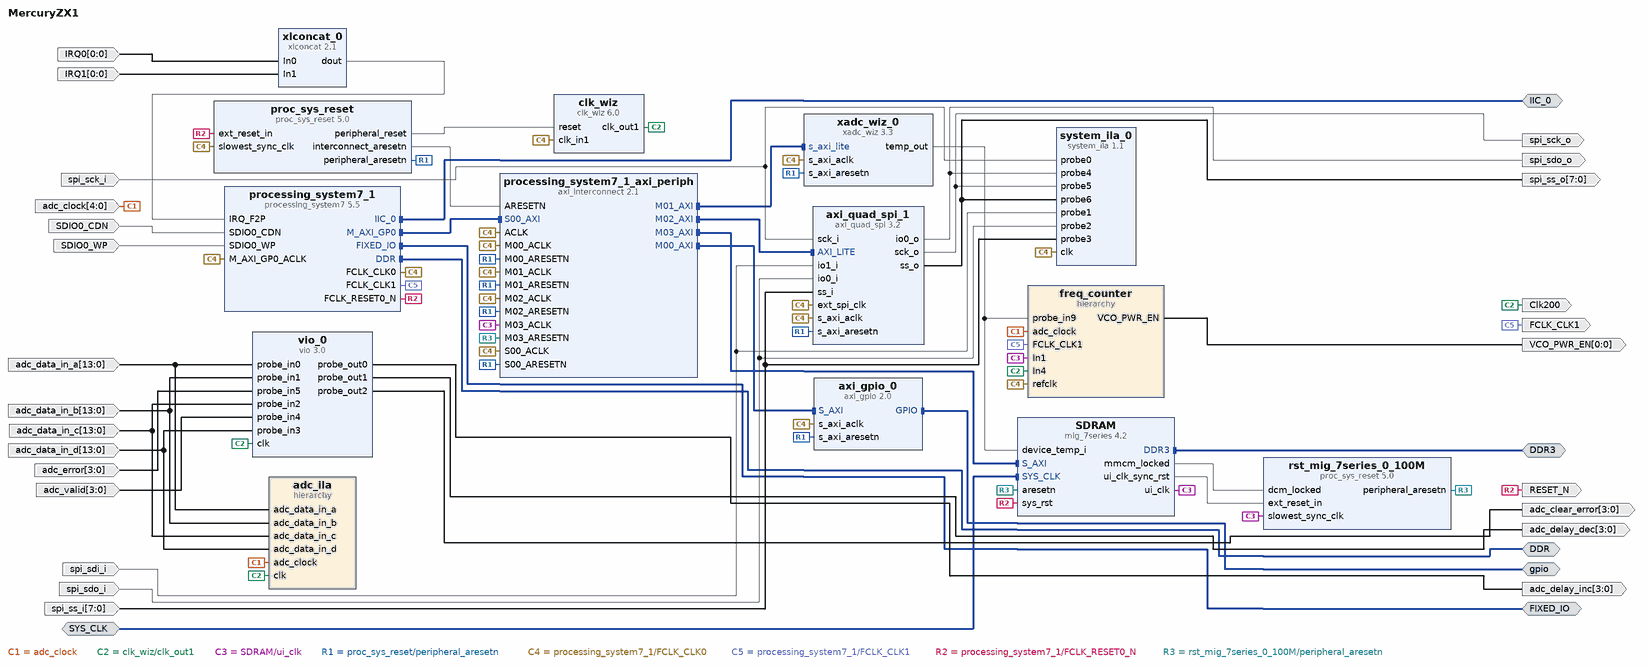
[diagram p0: block diagram of the top level]
# Vivado block design MercuryZX1, xc7z030fbg676-2, Vivado 2019.1
create_bd_design MercuryZX1

create_bd_intf_port -mode Master -vlnv xilinx.com:interface:ddrx_rtl:1.0 DDR
create_bd_intf_port -mode Master -vlnv xilinx.com:interface:ddrx_rtl:1.0 DDR3
create_bd_intf_port -mode Master -vlnv xilinx.com:display_processing_system7:fixedio_rtl:1.0 FIXED_IO
create_bd_intf_port -mode Master -vlnv xilinx.com:interface:iic_rtl:1.0 IIC_0
create_bd_intf_port -mode Slave -vlnv xilinx.com:interface:diff_clock_rtl:1.0 SYS_CLK
create_bd_intf_port -mode Master -vlnv xilinx.com:interface:gpio_rtl:1.0 gpio
create_bd_port -dir I spi_sck_i
create_bd_port -dir O spi_sck_o
create_bd_port -dir I spi_sdi_i
create_bd_port -dir I spi_sdo_i
create_bd_port -dir O spi_sdo_o
create_bd_port -dir I -from 7 -to 0 spi_ss_i
create_bd_port -dir O -from 7 -to 0 spi_ss_o
create_bd_port -dir O -type clk Clk200
create_bd_port -dir O -from 3 -to 0 adc_clear_error
create_bd_port -dir I -from 4 -to 0 adc_clock
create_bd_port -dir I -from 13 -to 0 adc_data_in_a
create_bd_port -dir I -from 13 -to 0 adc_data_in_b
create_bd_port -dir I -from 13 -to 0 adc_data_in_c
create_bd_port -dir I -from 13 -to 0 adc_data_in_d
create_bd_port -dir O -from 3 -to 0 adc_delay_dec
create_bd_port -dir O -from 3 -to 0 adc_delay_inc
create_bd_port -dir I -from 3 -to 0 adc_error
create_bd_port -dir I -from 3 -to 0 adc_valid
create_bd_port -dir O -type clk FCLK_CLK1
create_bd_port -dir I -from 0 -to 0 IRQ0
create_bd_port -dir I -from 0 -to 0 IRQ1
create_bd_port -dir O RESET_N
create_bd_port -dir I SDIO0_CDN
create_bd_port -dir I SDIO0_WP
create_bd_port -dir O -from 0 -to 0 VCO_PWR_EN

create_bd_cell -type ip -vlnv xilinx.com:ip:mig_7series:4.2 SDRAM
set_property -dict [list \
  CONFIG.BOARD_MIG_PARAM Custom \
  CONFIG.MIG_DONT_TOUCH_PARAM Custom \
  CONFIG.RESET_BOARD_INTERFACE Custom \
  CONFIG.XML_INPUT_FILE mig_a.prj \
] [get_bd_cells SDRAM]
create_bd_cell -type ip -vlnv xilinx.com:ip:axi_quad_spi:3.2 axi_quad_spi_1
set_property -dict {CONFIG.C_NUM_SS_BITS 8 CONFIG.C_USE_STARTUP 0} [get_bd_cells axi_quad_spi_1]
create_bd_cell -type ip -vlnv xilinx.com:ip:clk_wiz:6.0 clk_wiz
set_property -dict [list \
  CONFIG.CLKOUT1_JITTER 114.829 \
  CONFIG.CLKOUT1_REQUESTED_OUT_FREQ 200 \
  CONFIG.MMCM_CLKOUT0_DIVIDE_F 5.000 \
] [get_bd_cells clk_wiz]
create_bd_cell -type hier adc_ila
create_bd_cell -type hier freq_counter
create_bd_cell -type ip -vlnv xilinx.com:ip:system_ila:1.1 system_ila_0
set_property -dict [list \
  CONFIG.C_MON_TYPE NATIVE \
  CONFIG.C_NUM_OF_PROBES 7 \
  CONFIG.C_PROBE0_TYPE 0 \
  CONFIG.C_PROBE1_TYPE 0 \
  CONFIG.C_PROBE2_TYPE 0 \
  CONFIG.C_PROBE3_TYPE 0 \
  CONFIG.C_PROBE4_TYPE 0 \
  CONFIG.C_PROBE5_TYPE 0 \
  CONFIG.C_PROBE6_TYPE 0 \
] [get_bd_cells system_ila_0]
create_bd_cell -type ip -vlnv xilinx.com:ip:xlconcat:2.1 xlconcat_0
create_bd_cell -type ip -vlnv xilinx.com:ip:axi_gpio:2.0 axi_gpio_0
set_property -dict {CONFIG.C_ALL_OUTPUTS 1 CONFIG.C_GPIO_WIDTH 8} [get_bd_cells axi_gpio_0]
create_bd_cell -type ip -vlnv xilinx.com:ip:proc_sys_reset:5.0 proc_sys_reset
set_property -dict {CONFIG.C_AUX_RESET_HIGH 0} [get_bd_cells proc_sys_reset]
create_bd_cell -type ip -vlnv xilinx.com:ip:processing_system7:5.5 processing_system7_1
set_property -dict [list \
  CONFIG.PCW_APU_PERIPHERAL_FREQMHZ 666 \
  CONFIG.PCW_DCI_PERIPHERAL_CLKSRC 1 \
  CONFIG.PCW_ENET0_ENET0_IO {MIO 16 .. 27} \
  CONFIG.PCW_ENET0_GRP_MDIO_ENABLE 1 \
  CONFIG.PCW_ENET0_GRP_MDIO_IO {MIO 52 .. 53} \
  CONFIG.PCW_ENET0_PERIPHERAL_ENABLE 1 \
  CONFIG.PCW_ENET_RESET_ENABLE 0 \
  CONFIG.PCW_EN_CLK1_PORT 1 \
  CONFIG.PCW_FCLK_CLK1_BUF TRUE \
  CONFIG.PCW_FPGA0_PERIPHERAL_FREQMHZ 100 \
  CONFIG.PCW_FPGA2_PERIPHERAL_FREQMHZ 25 \
  CONFIG.PCW_FPGA3_PERIPHERAL_FREQMHZ 33 \
  CONFIG.PCW_FPGA_FCLK1_ENABLE 1 \
  CONFIG.PCW_GP0_EN_MODIFIABLE_TXN 0 \
  CONFIG.PCW_GP1_EN_MODIFIABLE_TXN 0 \
  CONFIG.PCW_GPIO_MIO_GPIO_ENABLE 1 \
  CONFIG.PCW_GPIO_MIO_GPIO_IO MIO \
  CONFIG.PCW_I2C0_I2C0_IO EMIO \
  CONFIG.PCW_I2C0_PERIPHERAL_ENABLE 1 \
  CONFIG.PCW_I2C_PERIPHERAL_FREQMHZ 111.111115 \
  CONFIG.PCW_I2C_RESET_ENABLE 0 \
  CONFIG.PCW_IRQ_F2P_INTR 1 \
  CONFIG.PCW_PCAP_PERIPHERAL_CLKSRC 1 \
  CONFIG.PCW_PRESET_BANK0_VOLTAGE {LVCMOS 2.5V} \
  CONFIG.PCW_PRESET_BANK1_VOLTAGE {LVCMOS 2.5V} \
  CONFIG.PCW_QSPI_GRP_FBCLK_ENABLE 1 \
  CONFIG.PCW_QSPI_GRP_FBCLK_IO {MIO 8} \
  CONFIG.PCW_QSPI_GRP_SINGLE_SS_ENABLE 1 \
  CONFIG.PCW_QSPI_GRP_SINGLE_SS_IO {MIO 1 .. 6} \
  CONFIG.PCW_QSPI_PERIPHERAL_ENABLE 1 \
  CONFIG.PCW_QSPI_QSPI_IO {MIO 1 .. 6} \
  CONFIG.PCW_SD0_GRP_CD_ENABLE 1 \
  CONFIG.PCW_SD0_GRP_CD_IO EMIO \
  CONFIG.PCW_SD0_GRP_WP_ENABLE 1 \
  CONFIG.PCW_SD0_GRP_WP_IO EMIO \
  CONFIG.PCW_SD0_PERIPHERAL_ENABLE 1 \
  CONFIG.PCW_SD0_SD0_IO {MIO 40 .. 45} \
  CONFIG.PCW_SDIO_PERIPHERAL_FREQMHZ 50 \
  CONFIG.PCW_SINGLE_QSPI_DATA_MODE x4 \
  CONFIG.PCW_TPIU_PERIPHERAL_CLKSRC {IO PLL} \
  CONFIG.PCW_TTC0_PERIPHERAL_ENABLE 1 \
  CONFIG.PCW_TTC0_TTC0_IO EMIO \
  CONFIG.PCW_UART0_PERIPHERAL_ENABLE 1 \
  CONFIG.PCW_UART0_UART0_IO {MIO 46 .. 47} \
  CONFIG.PCW_UART1_PERIPHERAL_ENABLE 0 \
  CONFIG.PCW_UART_PERIPHERAL_FREQMHZ 100 \
  CONFIG.PCW_UIPARAM_DDR_FREQ_MHZ 533 \
  CONFIG.PCW_UIPARAM_DDR_PARTNO {MT41K256M16 RE-125} \
  CONFIG.PCW_USB0_PERIPHERAL_ENABLE 1 \
  CONFIG.PCW_USB0_USB0_IO {MIO 28 .. 39} \
  CONFIG.PCW_USB_RESET_ENABLE 0 \
  CONFIG.PCW_USE_FABRIC_INTERRUPT 1 \
  CONFIG.PCW_WDT_PERIPHERAL_ENABLE 1 \
  CONFIG.PCW_WDT_WDT_IO EMIO \
] [get_bd_cells processing_system7_1]
# 263 more settings of processing_system7_1 are not shown: defaults, MIO pin electricals, DDR timing, and values the tool derives
create_bd_cell -type ip -vlnv xilinx.com:ip:axi_interconnect:2.1 processing_system7_1_axi_periph
set_property -dict {CONFIG.NUM_MI 4} [get_bd_cells processing_system7_1_axi_periph]
create_bd_cell -type ip -vlnv xilinx.com:ip:proc_sys_reset:5.0 rst_mig_7series_0_100M
create_bd_cell -type ip -vlnv xilinx.com:ip:xadc_wiz:3.3 xadc_wiz_0
set_property -dict [list \
  CONFIG.ENABLE_RESET false \
  CONFIG.ENABLE_TEMP_BUS true \
  CONFIG.INTERFACE_SELECTION Enable_AXI \
  CONFIG.TEMPERATURE_ALARM_OT_TRIGGER 85 \
] [get_bd_cells xadc_wiz_0]
create_bd_cell -type ip -vlnv xilinx.com:ip:vio:3.0 vio_0
set_property -dict [list \
  CONFIG.C_NUM_PROBE_IN 6 \
  CONFIG.C_NUM_PROBE_OUT 3 \
  CONFIG.C_PROBE_OUT0_WIDTH 4 \
  CONFIG.C_PROBE_OUT1_WIDTH 4 \
  CONFIG.C_PROBE_OUT2_WIDTH 4 \
] [get_bd_cells vio_0]

# ---- hierarchy /adc_ila ----
current_bd_instance /adc_ila
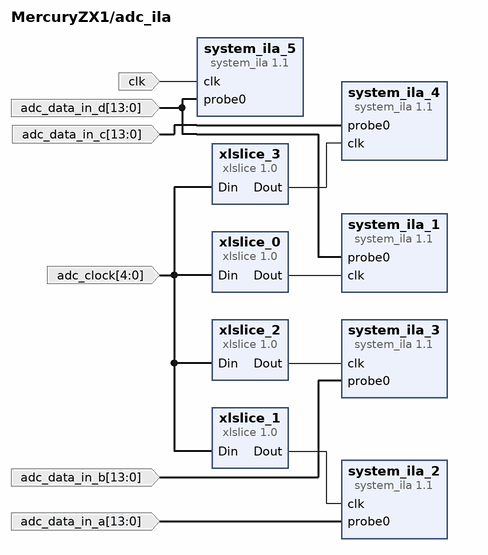
[diagram p1: block diagram inside /adc_ila]
create_bd_pin -dir I -from 4 -to 0 adc_clock
create_bd_pin -dir I -from 13 -to 0 adc_data_in_a
create_bd_pin -dir I -from 13 -to 0 adc_data_in_b
create_bd_pin -dir I -from 13 -to 0 adc_data_in_c
create_bd_pin -dir I -from 13 -to 0 adc_data_in_d
create_bd_pin -dir I -type clk clk

create_bd_cell -type ip -vlnv xilinx.com:ip:system_ila:1.1 system_ila_1
set_property -dict {CONFIG.C_MON_TYPE NATIVE CONFIG.C_NUM_OF_PROBES 1 CONFIG.C_PROBE0_TYPE 0} [get_bd_cells system_ila_1]
create_bd_cell -type ip -vlnv xilinx.com:ip:system_ila:1.1 system_ila_2
set_property -dict {CONFIG.C_MON_TYPE NATIVE CONFIG.C_NUM_OF_PROBES 1 CONFIG.C_PROBE0_TYPE 0} [get_bd_cells system_ila_2]
create_bd_cell -type ip -vlnv xilinx.com:ip:system_ila:1.1 system_ila_3
set_property -dict {CONFIG.C_MON_TYPE NATIVE CONFIG.C_NUM_OF_PROBES 1 CONFIG.C_PROBE0_TYPE 0} [get_bd_cells system_ila_3]
create_bd_cell -type ip -vlnv xilinx.com:ip:system_ila:1.1 system_ila_4
set_property -dict {CONFIG.C_MON_TYPE NATIVE CONFIG.C_NUM_OF_PROBES 1 CONFIG.C_PROBE0_TYPE 0} [get_bd_cells system_ila_4]
create_bd_cell -type ip -vlnv xilinx.com:ip:system_ila:1.1 system_ila_5
set_property -dict {CONFIG.C_MON_TYPE NATIVE CONFIG.C_NUM_OF_PROBES 1 CONFIG.C_PROBE0_TYPE 0} [get_bd_cells system_ila_5]
create_bd_cell -type ip -vlnv xilinx.com:ip:xlslice:1.0 xlslice_0
set_property -dict {CONFIG.DIN_FROM 0 CONFIG.DIN_TO 0 CONFIG.DIN_WIDTH 5} [get_bd_cells xlslice_0]
create_bd_cell -type ip -vlnv xilinx.com:ip:xlslice:1.0 xlslice_1
set_property -dict {CONFIG.DIN_FROM 1 CONFIG.DIN_TO 1 CONFIG.DIN_WIDTH 5 CONFIG.DOUT_WIDTH 1} [get_bd_cells xlslice_1]
create_bd_cell -type ip -vlnv xilinx.com:ip:xlslice:1.0 xlslice_2
set_property -dict {CONFIG.DIN_FROM 2 CONFIG.DIN_TO 2 CONFIG.DIN_WIDTH 5 CONFIG.DOUT_WIDTH 1} [get_bd_cells xlslice_2]
create_bd_cell -type ip -vlnv xilinx.com:ip:xlslice:1.0 xlslice_3
set_property -dict {CONFIG.DIN_FROM 3 CONFIG.DIN_TO 3 CONFIG.DIN_WIDTH 5 CONFIG.DOUT_WIDTH 1} [get_bd_cells xlslice_3]

# ---- hierarchy /freq_counter ----
current_bd_instance /freq_counter
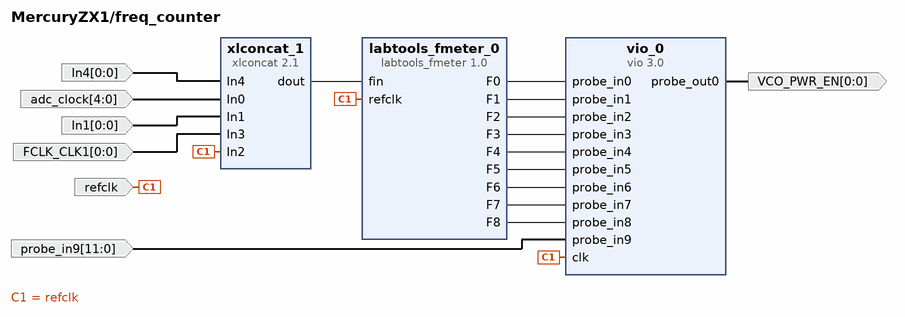
[diagram p2: block diagram inside /freq_counter]
create_bd_pin -dir I -from 0 -to 0 FCLK_CLK1
create_bd_pin -dir I -from 0 -to 0 In1
create_bd_pin -dir I -from 0 -to 0 In4
create_bd_pin -dir O -from 0 -to 0 VCO_PWR_EN
create_bd_pin -dir I -from 4 -to 0 adc_clock
create_bd_pin -dir I -from 11 -to 0 probe_in9
create_bd_pin -dir I -type clk refclk

create_bd_cell -type ip -vlnv trenz.biz:user:labtools_fmeter:1.0 labtools_fmeter_0
set_property -dict {CONFIG.C_CHANNELS 9} [get_bd_cells labtools_fmeter_0]
create_bd_cell -type ip -vlnv xilinx.com:ip:vio:3.0 vio_0
set_property -dict {CONFIG.C_NUM_PROBE_IN 10 CONFIG.C_PROBE_OUT0_INIT_VAL 0001} [get_bd_cells vio_0]
create_bd_cell -type ip -vlnv xilinx.com:ip:xlconcat:2.1 xlconcat_1
set_property -dict {CONFIG.IN0_WIDTH 5 CONFIG.NUM_PORTS 5} [get_bd_cells xlconcat_1]

# ---- connections ----

current_bd_instance /adc_ila
connect_bd_net [get_bd_pins adc_clock] [get_bd_pins xlslice_0/Din] [get_bd_pins xlslice_1/Din] [get_bd_pins xlslice_2/Din] [get_bd_pins xlslice_3/Din]
connect_bd_net -net adc_data_in_a_1 [get_bd_pins adc_data_in_a] [get_bd_pins system_ila_2/probe0]
connect_bd_net -net adc_data_in_b_1 [get_bd_pins adc_data_in_b] [get_bd_pins system_ila_3/probe0]
connect_bd_net -net adc_data_in_c_1 [get_bd_pins adc_data_in_c] [get_bd_pins system_ila_4/probe0]
connect_bd_net -net adc_data_in_d_1 [get_bd_pins adc_data_in_d] [get_bd_pins system_ila_1/probe0] [get_bd_pins system_ila_5/probe0]
connect_bd_net [get_bd_pins clk] [get_bd_pins system_ila_5/clk]
connect_bd_net [get_bd_pins xlslice_0/Dout] [get_bd_pins system_ila_1/clk]
connect_bd_net [get_bd_pins xlslice_1/Dout] [get_bd_pins system_ila_2/clk]
connect_bd_net [get_bd_pins xlslice_2/Dout] [get_bd_pins system_ila_3/clk]
connect_bd_net [get_bd_pins xlslice_3/Dout] [get_bd_pins system_ila_4/clk]
set_property HDL_ATTRIBUTE.DEBUG true [get_bd_nets adc_data_in_a_1]
set_property HDL_ATTRIBUTE.DEBUG true [get_bd_nets adc_data_in_b_1]
set_property HDL_ATTRIBUTE.DEBUG true [get_bd_nets adc_data_in_c_1]
set_property HDL_ATTRIBUTE.DEBUG true [get_bd_nets adc_data_in_d_1]
set_property HDL_ATTRIBUTE.MARK_DEBUG true [get_bd_nets adc_data_in_d_1]

current_bd_instance /freq_counter
connect_bd_net -net In4_1 [get_bd_pins In4] [get_bd_pins xlconcat_1/In4]
connect_bd_net [get_bd_pins adc_clock] [get_bd_pins xlconcat_1/In0]
connect_bd_net [get_bd_pins labtools_fmeter_0/F0] [get_bd_pins vio_0/probe_in0]
connect_bd_net [get_bd_pins labtools_fmeter_0/F1] [get_bd_pins vio_0/probe_in1]
connect_bd_net [get_bd_pins labtools_fmeter_0/F2] [get_bd_pins vio_0/probe_in2]
connect_bd_net [get_bd_pins labtools_fmeter_0/F3] [get_bd_pins vio_0/probe_in3]
connect_bd_net [get_bd_pins labtools_fmeter_0/F4] [get_bd_pins vio_0/probe_in4]
connect_bd_net [get_bd_pins labtools_fmeter_0/F5] [get_bd_pins vio_0/probe_in5]
connect_bd_net [get_bd_pins labtools_fmeter_0/F6] [get_bd_pins vio_0/probe_in6]
connect_bd_net [get_bd_pins labtools_fmeter_0/F7] [get_bd_pins vio_0/probe_in7]
connect_bd_net [get_bd_pins labtools_fmeter_0/F8] [get_bd_pins vio_0/probe_in8]
connect_bd_net -net mig_7series_0_ui_clk [get_bd_pins In1] [get_bd_pins xlconcat_1/In1]
connect_bd_net -net probe_in9_1 [get_bd_pins probe_in9] [get_bd_pins vio_0/probe_in9]
connect_bd_net -net processing_system7_1_fclk_clk0 [get_bd_pins refclk] \
  [get_bd_pins labtools_fmeter_0/refclk] [get_bd_pins vio_0/clk] [get_bd_pins xlconcat_1/In2]
connect_bd_net -net processing_system7_1_fclk_clk1 [get_bd_pins FCLK_CLK1] [get_bd_pins xlconcat_1/In3]
connect_bd_net [get_bd_pins vio_0/probe_out0] [get_bd_pins VCO_PWR_EN]
connect_bd_net [get_bd_pins xlconcat_1/dout] [get_bd_pins labtools_fmeter_0/fin]

current_bd_instance /
connect_bd_intf_net [get_bd_intf_ports IIC_0] [get_bd_intf_pins processing_system7_1/IIC_0]
connect_bd_intf_net [get_bd_intf_ports FIXED_IO] [get_bd_intf_pins processing_system7_1/FIXED_IO]
connect_bd_intf_net [get_bd_intf_pins processing_system7_1/M_AXI_GP0] [get_bd_intf_pins processing_system7_1_axi_periph/S00_AXI]
connect_bd_intf_net [get_bd_intf_pins SDRAM/S_AXI] [get_bd_intf_pins processing_system7_1_axi_periph/M03_AXI]
connect_bd_intf_net [get_bd_intf_pins axi_quad_spi_1/AXI_LITE] [get_bd_intf_pins processing_system7_1_axi_periph/M02_AXI]
connect_bd_intf_net [get_bd_intf_ports DDR] [get_bd_intf_pins processing_system7_1/DDR]
connect_bd_intf_net [get_bd_intf_pins axi_gpio_0/S_AXI] [get_bd_intf_pins processing_system7_1_axi_periph/M00_AXI]
connect_bd_intf_net [get_bd_intf_pins processing_system7_1_axi_periph/M01_AXI] [get_bd_intf_pins xadc_wiz_0/s_axi_lite]
connect_bd_intf_net -intf_net mig_7series_0_DDR3 [get_bd_intf_ports DDR3] [get_bd_intf_pins SDRAM/DDR3]
connect_bd_intf_net -intf_net axi_gpio_1_gpio [get_bd_intf_ports gpio] [get_bd_intf_pins axi_gpio_0/GPIO]
connect_bd_intf_net [get_bd_intf_ports SYS_CLK] [get_bd_intf_pins SDRAM/SYS_CLK]
connect_bd_net -net In0_1 [get_bd_ports IRQ0] [get_bd_pins xlconcat_0/In0]
connect_bd_net -net In1_1 [get_bd_ports IRQ1] [get_bd_pins xlconcat_0/In1]
connect_bd_net [get_bd_ports SDIO0_CDN] [get_bd_pins processing_system7_1/SDIO0_CDN]
connect_bd_net [get_bd_ports SDIO0_WP] [get_bd_pins processing_system7_1/SDIO0_WP]
connect_bd_net [get_bd_ports adc_clock] [get_bd_pins adc_ila/adc_clock] [get_bd_pins freq_counter/adc_clock]
connect_bd_net -net adc_data_in_a_1 [get_bd_ports adc_data_in_a] [get_bd_pins adc_ila/adc_data_in_a] [get_bd_pins vio_0/probe_in0]
connect_bd_net -net adc_data_in_b_1 [get_bd_ports adc_data_in_b] [get_bd_pins adc_ila/adc_data_in_b] [get_bd_pins vio_0/probe_in1]
connect_bd_net -net adc_data_in_c_1 [get_bd_ports adc_data_in_c] [get_bd_pins adc_ila/adc_data_in_c] [get_bd_pins vio_0/probe_in2]
connect_bd_net -net adc_data_in_d_1 [get_bd_ports adc_data_in_d] [get_bd_pins adc_ila/adc_data_in_d] [get_bd_pins vio_0/probe_in3]
connect_bd_net [get_bd_ports adc_error] [get_bd_pins vio_0/probe_in5]
connect_bd_net [get_bd_ports adc_valid] [get_bd_pins vio_0/probe_in4]
connect_bd_net -net axi_quad_spi_1_io0_o [get_bd_pins axi_quad_spi_1/io0_o] [get_bd_ports spi_sdo_o] [get_bd_pins system_ila_0/probe4]
connect_bd_net -net axi_quad_spi_1_sck_o [get_bd_pins axi_quad_spi_1/sck_o] [get_bd_ports spi_sck_o] [get_bd_pins system_ila_0/probe5]
connect_bd_net -net axi_quad_spi_1_ss_o [get_bd_pins axi_quad_spi_1/ss_o] [get_bd_ports spi_ss_o] [get_bd_pins system_ila_0/probe6]
connect_bd_net [get_bd_pins clk_wiz/clk_out1] [get_bd_ports Clk200] [get_bd_pins adc_ila/clk] [get_bd_pins freq_counter/In4] [get_bd_pins vio_0/clk]
connect_bd_net [get_bd_pins freq_counter/VCO_PWR_EN] [get_bd_ports VCO_PWR_EN]
connect_bd_net -net mig_7series_0_mmcm_locked [get_bd_pins SDRAM/mmcm_locked] [get_bd_pins rst_mig_7series_0_100M/dcm_locked]
connect_bd_net -net mig_7series_0_ui_clk [get_bd_pins SDRAM/ui_clk] \
  [get_bd_pins freq_counter/In1] [get_bd_pins processing_system7_1_axi_periph/M03_ACLK] \
  [get_bd_pins rst_mig_7series_0_100M/slowest_sync_clk]
connect_bd_net -net mig_7series_0_ui_clk_sync_rst [get_bd_pins SDRAM/ui_clk_sync_rst] [get_bd_pins rst_mig_7series_0_100M/ext_reset_in]
connect_bd_net [get_bd_pins proc_sys_reset/interconnect_aresetn] [get_bd_pins processing_system7_1_axi_periph/ARESETN]
connect_bd_net [get_bd_pins proc_sys_reset/peripheral_aresetn] \
  [get_bd_pins axi_gpio_0/s_axi_aresetn] [get_bd_pins axi_quad_spi_1/s_axi_aresetn] \
  [get_bd_pins processing_system7_1_axi_periph/M00_ARESETN] [get_bd_pins processing_system7_1_axi_periph/M01_ARESETN] \
  [get_bd_pins processing_system7_1_axi_periph/M02_ARESETN] [get_bd_pins processing_system7_1_axi_periph/S00_ARESETN] \
  [get_bd_pins xadc_wiz_0/s_axi_aresetn]
connect_bd_net [get_bd_pins proc_sys_reset/peripheral_reset] [get_bd_pins clk_wiz/reset]
connect_bd_net [get_bd_pins processing_system7_1/FCLK_CLK0] \
  [get_bd_pins axi_gpio_0/s_axi_aclk] [get_bd_pins axi_quad_spi_1/ext_spi_clk] [get_bd_pins axi_quad_spi_1/s_axi_aclk] \
  [get_bd_pins clk_wiz/clk_in1] [get_bd_pins freq_counter/refclk] [get_bd_pins proc_sys_reset/slowest_sync_clk] \
  [get_bd_pins processing_system7_1/M_AXI_GP0_ACLK] [get_bd_pins processing_system7_1_axi_periph/ACLK] \
  [get_bd_pins processing_system7_1_axi_periph/M00_ACLK] [get_bd_pins processing_system7_1_axi_periph/M01_ACLK] \
  [get_bd_pins processing_system7_1_axi_periph/M02_ACLK] [get_bd_pins processing_system7_1_axi_periph/S00_ACLK] \
  [get_bd_pins system_ila_0/clk] [get_bd_pins xadc_wiz_0/s_axi_aclk]
connect_bd_net [get_bd_pins processing_system7_1/FCLK_CLK1] [get_bd_ports FCLK_CLK1] [get_bd_pins freq_counter/FCLK_CLK1]
connect_bd_net [get_bd_pins processing_system7_1/FCLK_RESET0_N] \
  [get_bd_ports RESET_N] [get_bd_pins SDRAM/sys_rst] [get_bd_pins proc_sys_reset/ext_reset_in]
connect_bd_net [get_bd_pins rst_mig_7series_0_100M/peripheral_aresetn] \
  [get_bd_pins SDRAM/aresetn] [get_bd_pins processing_system7_1_axi_periph/M03_ARESETN]
connect_bd_net -net spi_sck_i_1 [get_bd_ports spi_sck_i] [get_bd_pins axi_quad_spi_1/sck_i] [get_bd_pins system_ila_0/probe0]
connect_bd_net -net spi_sdi_i_1 [get_bd_ports spi_sdi_i] [get_bd_pins axi_quad_spi_1/io1_i] [get_bd_pins system_ila_0/probe1]
connect_bd_net -net spi_sdo_i_1 [get_bd_ports spi_sdo_i] [get_bd_pins axi_quad_spi_1/io0_i] [get_bd_pins system_ila_0/probe2]
connect_bd_net -net spi_sdo_iss_i_1 [get_bd_ports spi_ss_i] [get_bd_pins axi_quad_spi_1/ss_i] [get_bd_pins system_ila_0/probe3]
connect_bd_net [get_bd_pins vio_0/probe_out0] [get_bd_ports adc_delay_inc]
connect_bd_net [get_bd_pins vio_0/probe_out1] [get_bd_ports adc_delay_dec]
connect_bd_net [get_bd_pins vio_0/probe_out2] [get_bd_ports adc_clear_error]
connect_bd_net [get_bd_pins xadc_wiz_0/temp_out] [get_bd_pins SDRAM/device_temp_i] [get_bd_pins freq_counter/probe_in9]
connect_bd_net [get_bd_pins xlconcat_0/dout] [get_bd_pins processing_system7_1/IRQ_F2P]
set_property HDL_ATTRIBUTE.DEBUG true [get_bd_nets adc_data_in_a_1]
set_property HDL_ATTRIBUTE.MARK_DEBUG true [get_bd_nets adc_data_in_a_1]
set_property HDL_ATTRIBUTE.DEBUG true [get_bd_nets adc_data_in_b_1]
set_property HDL_ATTRIBUTE.MARK_DEBUG true [get_bd_nets adc_data_in_b_1]
set_property HDL_ATTRIBUTE.DEBUG true [get_bd_nets adc_data_in_c_1]
set_property HDL_ATTRIBUTE.MARK_DEBUG true [get_bd_nets adc_data_in_c_1]
set_property HDL_ATTRIBUTE.DEBUG true [get_bd_nets adc_data_in_d_1]
set_property HDL_ATTRIBUTE.MARK_DEBUG true [get_bd_nets adc_data_in_d_1]
set_property HDL_ATTRIBUTE.DEBUG true [get_bd_nets axi_quad_spi_1_io0_o]
set_property HDL_ATTRIBUTE.MARK_DEBUG true [get_bd_nets axi_quad_spi_1_io0_o]
set_property HDL_ATTRIBUTE.DEBUG true [get_bd_nets axi_quad_spi_1_sck_o]
set_property HDL_ATTRIBUTE.MARK_DEBUG true [get_bd_nets axi_quad_spi_1_sck_o]
set_property HDL_ATTRIBUTE.DEBUG true [get_bd_nets axi_quad_spi_1_ss_o]
set_property HDL_ATTRIBUTE.MARK_DEBUG true [get_bd_nets axi_quad_spi_1_ss_o]
set_property HDL_ATTRIBUTE.DEBUG true [get_bd_nets spi_sck_i_1]
set_property HDL_ATTRIBUTE.MARK_DEBUG true [get_bd_nets spi_sck_i_1]
set_property HDL_ATTRIBUTE.DEBUG true [get_bd_nets spi_sdi_i_1]
set_property HDL_ATTRIBUTE.MARK_DEBUG true [get_bd_nets spi_sdi_i_1]
set_property HDL_ATTRIBUTE.DEBUG true [get_bd_nets spi_sdo_i_1]
set_property HDL_ATTRIBUTE.MARK_DEBUG true [get_bd_nets spi_sdo_i_1]
set_property HDL_ATTRIBUTE.DEBUG true [get_bd_nets spi_sdo_iss_i_1]
set_property HDL_ATTRIBUTE.MARK_DEBUG true [get_bd_nets spi_sdo_iss_i_1]

# ---- address map ----
assign_bd_address -offset 0x41200000 -range 64K -target_address_space [get_bd_addr_spaces processing_system7_1/Data] [get_bd_addr_segs axi_gpio_0/S_AXI/Reg]
assign_bd_address -offset 0x41E00000 -range 64K -target_address_space [get_bd_addr_spaces processing_system7_1/Data] [get_bd_addr_segs axi_quad_spi_1/AXI_LITE/Reg]
assign_bd_address -offset 0x43C00000 -range 64K -target_address_space [get_bd_addr_spaces processing_system7_1/Data] [get_bd_addr_segs xadc_wiz_0/s_axi_lite/Reg]
assign_bd_address -offset 0x50000000 -range 256M -target_address_space [get_bd_addr_spaces processing_system7_1/Data] [get_bd_addr_segs SDRAM/memmap/memaddr]

validate_bd_design
save_bd_design
